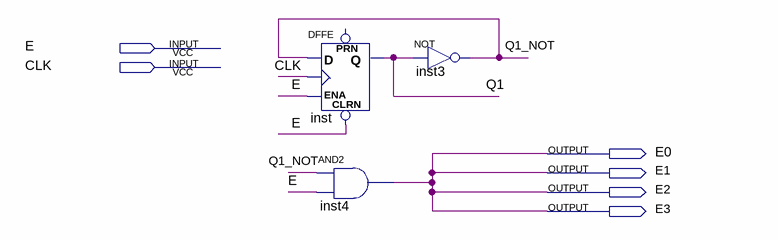
[diagram p0: schematic sheet]
// Quartus schematic EmergencyController.bdf as structural Verilog: 3 symbols, 6 pins
module EmergencyController (
  input  E,
  input  CLK,
  output E0,
  output E1,
  output E2,
  output E3
);

  wire Q1, Q1_NOT;

  DFFE inst (.CLRN(E), .D(Q1_NOT), .CLK(CLK), .ENA(E), .Q(Q1));  // open: PRN
  and inst4 (E0, Q1_NOT, E);
  not inst3 (Q1_NOT, Q1);

  assign E1 = E0;
  assign E2 = E0;
  assign E3 = E0;
endmodule
